# EAGLE schematic hmc_power (EAGLE 7.5.0)
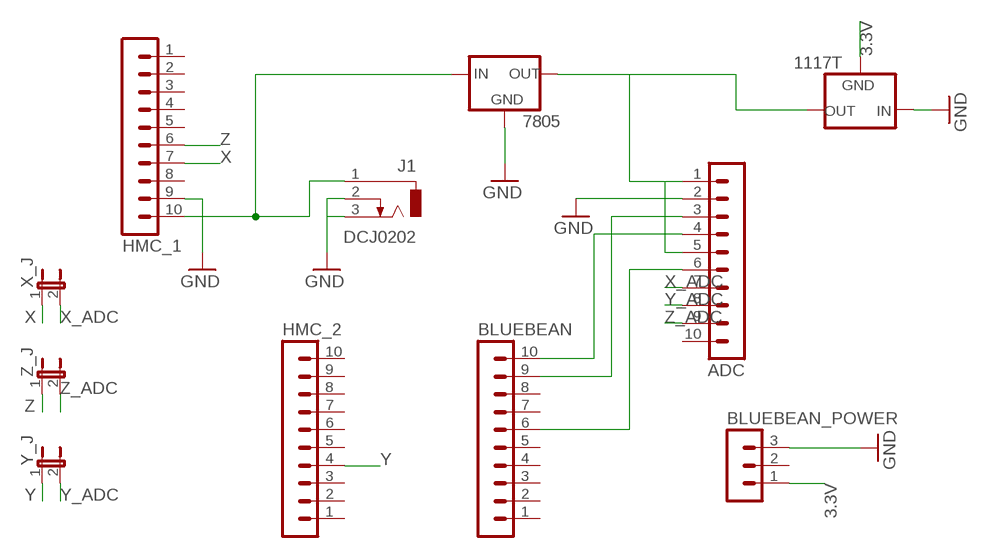
[diagram p0: schematic, sheet 1]

## Parts
1117T  78XXL  [78XXL]
7805  78XXL  [78XXL]
ADC  MA10-1  [MA10-1]
BLUEBEAN  MA10-1  [MA10-1]
BLUEBEAN_POWER  MA03-1  [MA03-1]
HMC_1  MA10-1  [MA10-1]
HMC_2  MA10-1  [MA10-1]
J1  DCJ0202  [DCJ0202]
X_J  JP1E  [JP1]
Y_J  JP1E  [JP1]
Z_J  JP1E  [JP1]

## Nets
3.3V: 1117T.GND BLUEBEAN_POWER.1
A1: 7805.IN HMC_1.10 J1.1
GND: 1117T.IN 7805.GND ADC.2 BLUEBEAN_POWER.3 HMC_1.9 J1.2 J1.3
N$1: 1117T.OUT 7805.OUT ADC.1 ADC.5
N$2: ADC.3 BLUEBEAN.9
N$3: ADC.4 BLUEBEAN.10
N$4: ADC.6 BLUEBEAN.6
X: HMC_1.7 X_J.1
X_ADC: ADC.7 X_J.2
Y: HMC_2.4 Y_J.1
Y_ADC: ADC.8 Y_J.2
Z: HMC_1.6 Z_J.1
Z_ADC: ADC.9 Z_J.2
Unconnected: ADC.10 BLUEBEAN.1 BLUEBEAN.2 BLUEBEAN.3 BLUEBEAN.4 BLUEBEAN.5 BLUEBEAN.7 BLUEBEAN.8 BLUEBEAN_POWER.2 HMC_1.1 HMC_1.2 HMC_1.3 HMC_1.4 HMC_1.5 HMC_1.8 HMC_2.1 HMC_2.2 HMC_2.3 HMC_2.5 HMC_2.6 HMC_2.7 HMC_2.8 HMC_2.9 HMC_2.10

## Library data of the parts
1117T 7805 = v-reg:78XXL: VOLTAGE REGULATOR
ADC BLUEBEAN HMC_1 HMC_2 = con-lstb:MA10-1: PIN HEADER; OC_FARNELL: unknown; OC_NEWARK: unknown
BLUEBEAN_POWER = con-lstb:MA03-1: PIN HEADER; OC_FARNELL: unknown; OC_NEWARK: unknown
J1 = dc-jack (1):DCJ0202: DC POWER JACK Source: DCJ0202.pdf
X_J Y_J Z_J = jumper:JP1E: JUMPER